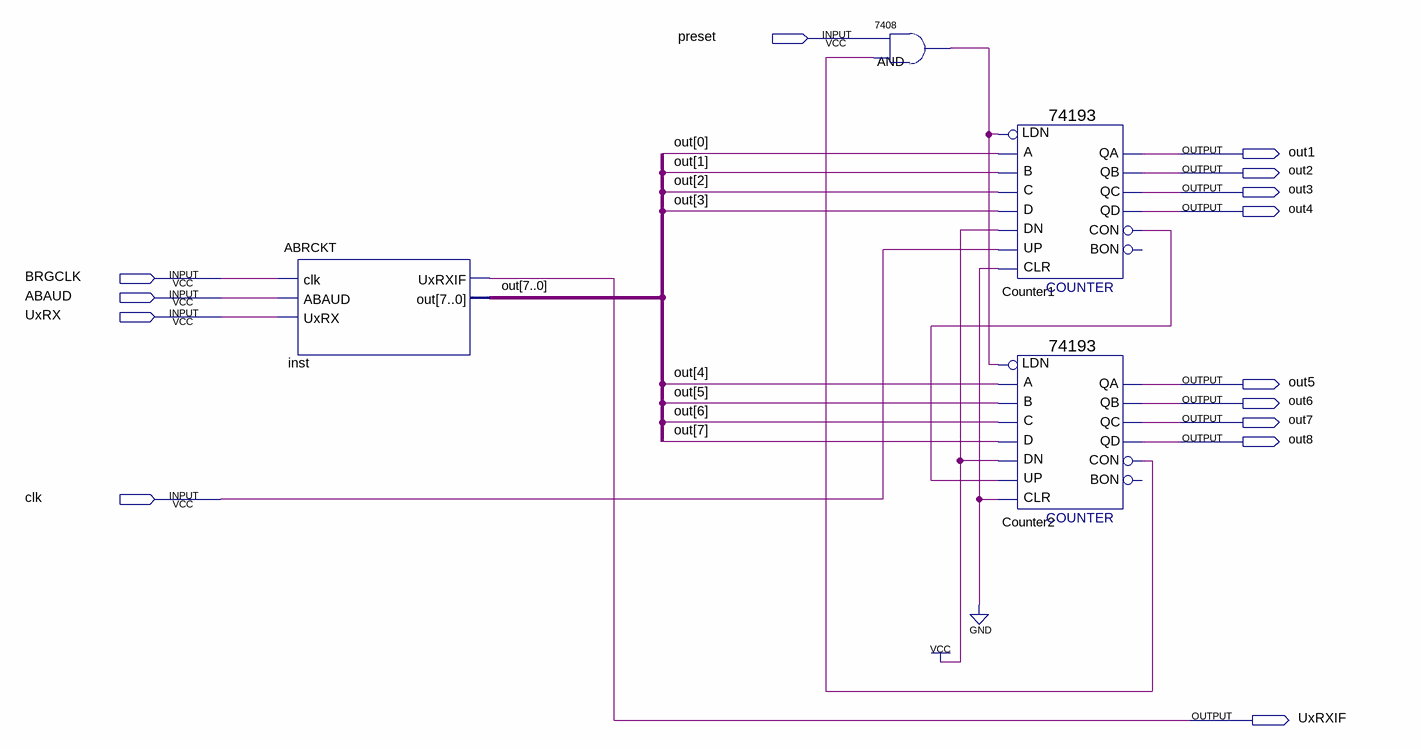
[diagram p0: schematic sheet]
// Quartus schematic Block1.bdf as structural Verilog: 4 symbols, 14 pins
module Block1 (
  input  preset,
  input  BRGCLK,
  input  ABAUD,
  input  UxRX,
  input  clk,
  output out1,
  output out2,
  output out3,
  output out4,
  output out5,
  output out6,
  output out7,
  output out8,
  output UxRXIF
);

  wire AND_1, Counter1_con, Counter2_con;
  wire [0:0] out;

  ABRCKT inst (
    .clk(BRGCLK), .ABAUD(ABAUD), .UxRX(UxRX), .UxRXIF(UxRXIF),
    .out({out7, out6, out5, out4, out3, out2, out1, out[0]}));
  \7408  AND (.\3 (Counter2_con), .\2 (preset), .\1 (AND_1));
  \74193  Counter1 (
    .D(out3), .C(out2), .B(out1), .A(out[0]), .CLR(1'b0), .UP(clk), .DN(1'b1), .LDN(AND_1), .QB(out2),
    .QA(out1), .CON(Counter1_con), .QD(out4), .QC(out3));  // open: BON
  \74193  Counter2 (
    .D(out7), .C(out6), .B(out5), .A(out4), .CLR(1'b0), .UP(Counter1_con), .DN(1'b1), .LDN(AND_1), .QB(out6),
    .QA(out5), .CON(Counter2_con), .QD(out8), .QC(out7));  // open: BON
endmodule
